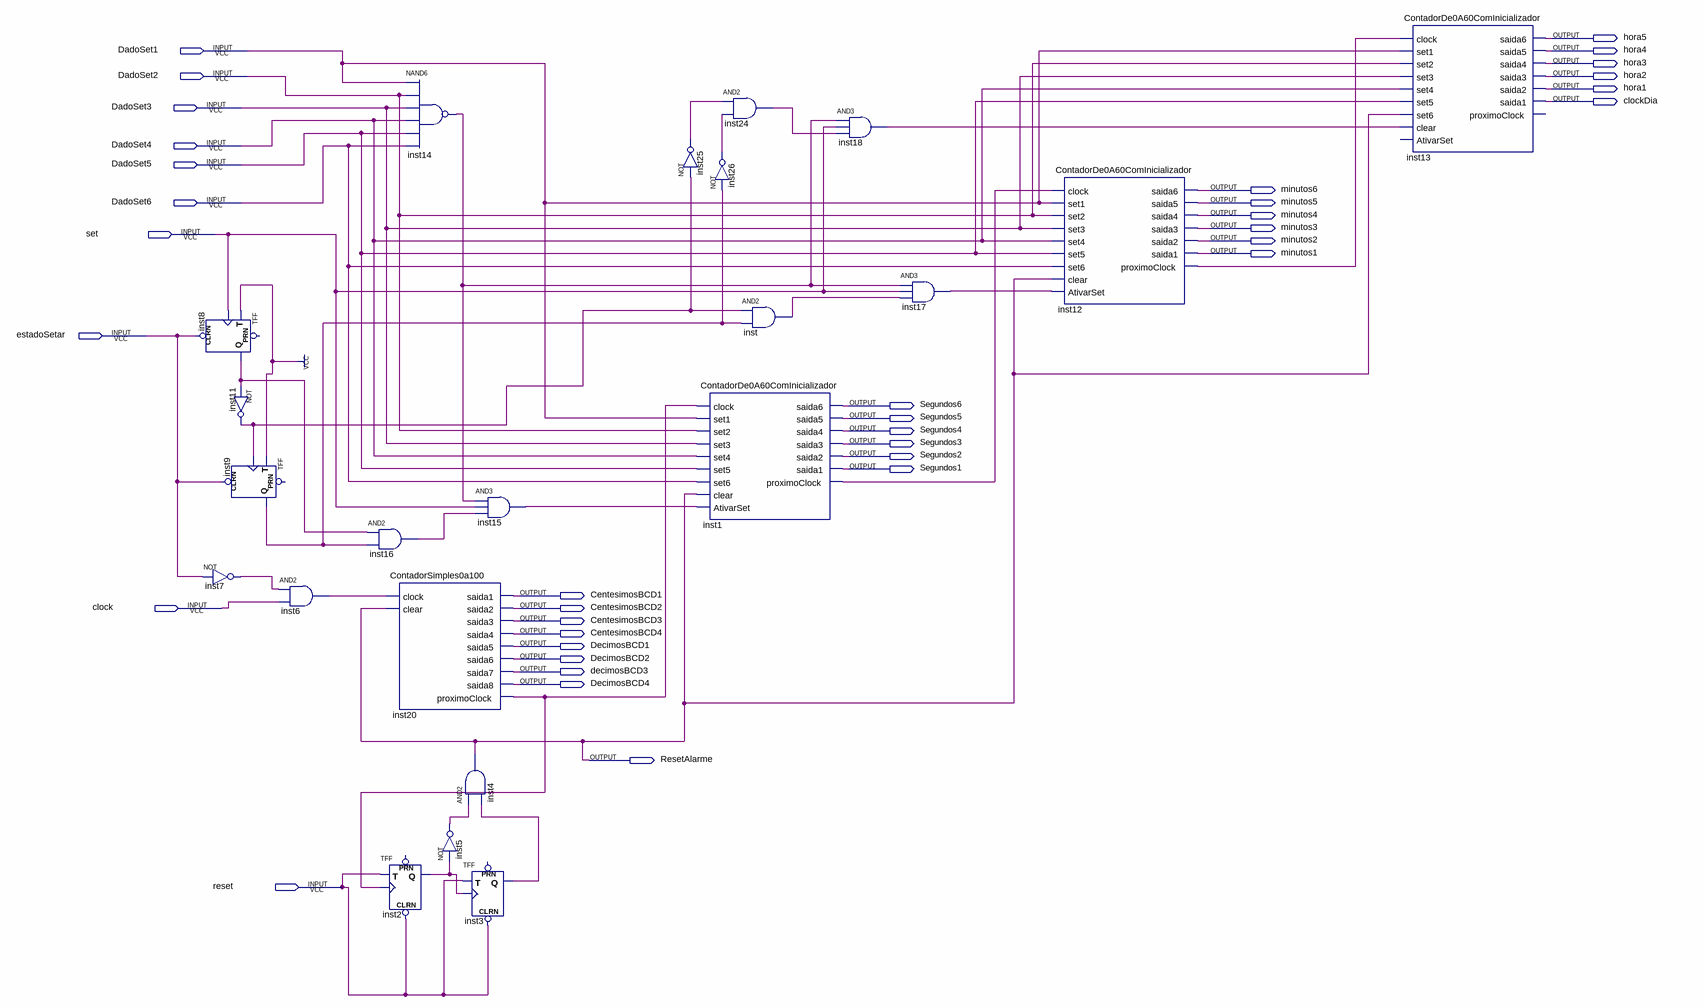
[diagram p0: schematic sheet]
// Quartus schematic Relogio.bdf as structural Verilog: 22 symbols, 37 pins
module Relogio (
  input  DadoSet1,
  input  DadoSet2,
  input  DadoSet3,
  input  DadoSet4,
  input  DadoSet5,
  input  DadoSet6,
  input  set,
  input  estadoSetar,
  input  clock,
  input  reset,
  output hora5,
  output hora4,
  output hora3,
  output hora2,
  output hora1,
  output clockDia,
  output minutos6,
  output minutos5,
  output minutos4,
  output minutos3,
  output minutos2,
  output minutos1,
  output Segundos6,
  output Segundos5,
  output Segundos4,
  output Segundos3,
  output Segundos2,
  output Segundos1,
  output CentesimosBCD1,
  output CentesimosBCD2,
  output CentesimosBCD3,
  output CentesimosBCD4,
  output DecimosBCD1,
  output DecimosBCD2,
  output decimosBCD3,
  output DecimosBCD4,
  output ResetAlarme
);

  wire inst1_proximoclock, inst2_q, inst3_q, inst5_out, inst6_out, inst7_out, inst8_q, inst9_q, inst11_out,
       inst12_proximoclock, inst14_out, inst15_out, inst16_out, inst17_out, inst18_out, inst20_proximoclock,
       inst24_out, inst25_out, inst26_out, inst_out;

  TFF inst8 (.CLRN(estadoSetar), .T(1'b1), .CLK(set), .Q(inst8_q));  // open: PRN
  not inst11 (inst11_out, inst8_q);
  TFF inst9 (.CLRN(estadoSetar), .T(1'b1), .CLK(inst11_out), .Q(inst9_q));  // open: PRN
  not inst7 (inst7_out, estadoSetar);
  and inst6 (inst6_out, inst7_out, clock);
  and inst16 (inst16_out, inst8_q, inst9_q);
  ContadorSimples0a100 inst20 (
    .clock(inst6_out), .clear(ResetAlarme), .saida1(CentesimosBCD1), .saida2(CentesimosBCD2),
    .saida3(CentesimosBCD3), .saida4(CentesimosBCD4), .saida5(DecimosBCD1), .saida6(DecimosBCD2),
    .saida7(decimosBCD3), .saida8(DecimosBCD4), .proximoClock(inst20_proximoclock));
  TFF inst2 (.CLRN(reset), .T(reset), .CLK(inst20_proximoclock), .Q(inst2_q));  // open: PRN
  nand inst14 (inst14_out, DadoSet1, DadoSet2, DadoSet3, DadoSet4, DadoSet5, DadoSet6);
  not inst5 (inst5_out, inst2_q);
  and inst15 (inst15_out, inst14_out, set, inst16_out);
  and inst4 (ResetAlarme, inst5_out, inst3_q);
  TFF inst3 (.CLRN(reset), .T(reset), .CLK(inst2_q), .Q(inst3_q));  // open: PRN
  not inst25 (inst25_out, inst11_out);
  ContadorDe0A60ComInicializador inst1 (
    .clock(inst20_proximoclock), .set1(DadoSet1), .set2(DadoSet2), .set3(DadoSet3), .set4(DadoSet4),
    .set5(DadoSet5), .set6(DadoSet6), .clear(ResetAlarme), .AtivarSet(inst15_out), .saida6(Segundos6),
    .saida5(Segundos5), .saida4(Segundos4), .saida3(Segundos3), .saida2(Segundos2), .saida1(Segundos1),
    .proximoClock(inst1_proximoclock));
  and inst24 (inst24_out, inst25_out, inst26_out);
  not inst26 (inst26_out, inst9_q);
  and inst (inst_out, inst11_out, inst9_q);
  and inst18 (inst18_out, inst14_out, set, inst24_out);
  and inst17 (inst17_out, inst14_out, set, inst_out);
  ContadorDe0A60ComInicializador inst12 (
    .clock(inst1_proximoclock), .set1(DadoSet1), .set2(DadoSet2), .set3(DadoSet3), .set4(DadoSet4),
    .set5(DadoSet5), .set6(DadoSet6), .clear(ResetAlarme), .AtivarSet(inst17_out), .saida6(minutos6),
    .saida5(minutos5), .saida4(minutos4), .saida3(minutos3), .saida2(minutos2), .saida1(minutos1),
    .proximoClock(inst12_proximoclock));
  ContadorDe0A60ComInicializador inst13 (
    .clock(inst12_proximoclock), .set1(DadoSet1), .set2(DadoSet2), .set3(DadoSet3), .set4(DadoSet4),
    .set5(DadoSet5), .set6(ResetAlarme), .clear(inst18_out), .saida6(hora5), .saida5(hora4), .saida4(hora3),
    .saida3(hora2), .saida2(hora1), .saida1(clockDia));  // open: AtivarSet, proximoClock
endmodule
